# EAGLE design mem (EAGLE 8.0.2)
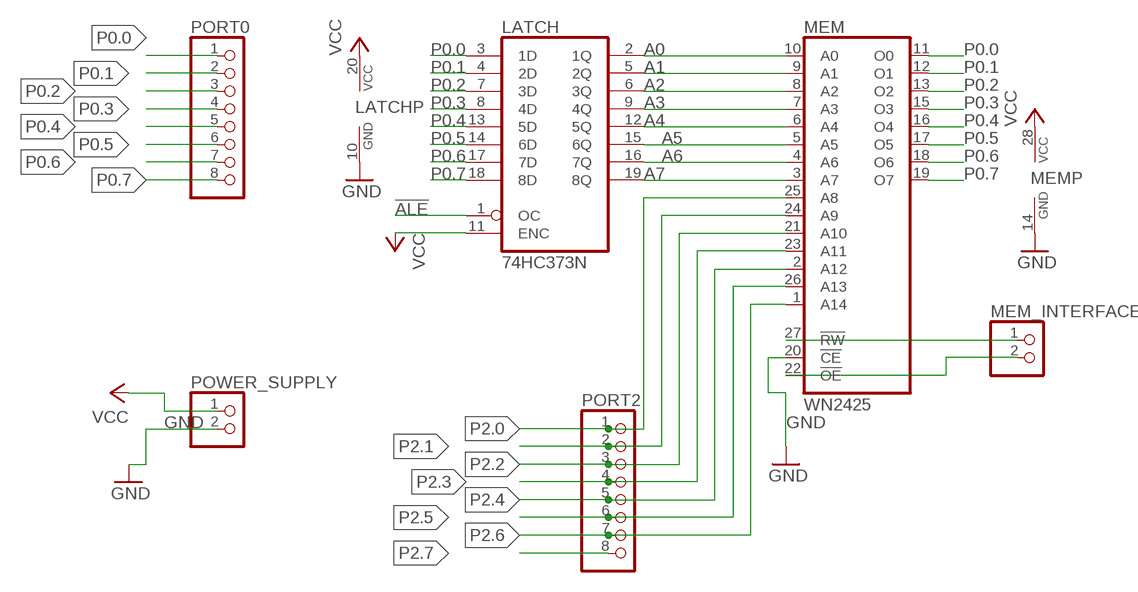
[diagram p0: schematic, sheet 1]

## Parts
LATCH  74HC373N  [DIL20]
MEM  WN2425  TC55257DP  [DIL28]
MEM_INTERFACE  PINHD-1X2  [1X02]
PORT0  PINHD-1X8  [1X08]
PORT2  PINHD-1X8  [1X08]
POWER_SUPPLY  PINHD-1X2  [1X02]

## Nets
!ALE: LATCH.1(OC)
A0: LATCH.2(1Q) MEM.10(A0)
A1: LATCH.5(2Q) MEM.9(A1)
A2: LATCH.6(3Q) MEM.8(A2)
A3: LATCH.9(4Q) MEM.7(A3)
A4: LATCH.12(5Q) MEM.6(A4)
A5: LATCH.15(6Q) MEM.5(A5)
A6: LATCH.16(7Q) MEM.4(A6)
A7: LATCH.19(8Q) MEM.3(A7)
GND: LATCH.10(GND) MEM.14(GND) MEM.20(!CE) POWER_SUPPLY.2
P0.0: LATCH.3(1D) MEM.11(O0) PORT0.1
P0.1: LATCH.4(2D) MEM.12(O1) PORT0.2
P0.2: LATCH.7(3D) MEM.13(O2) PORT0.3
P0.3: LATCH.8(4D) MEM.15(O3) PORT0.4
P0.4: LATCH.13(5D) MEM.16(O4) PORT0.5
P0.5: LATCH.14(6D) MEM.17(O5) PORT0.6
P0.6: LATCH.17(7D) MEM.18(O6) PORT0.7
P0.7: LATCH.18(8D) MEM.19(O7) PORT0.8
P2.0: MEM.25(A8) PORT2.1
P2.1: MEM.24(A9) PORT2.2
P2.2: MEM.21(A10) PORT2.3
P2.3: MEM.23(A11) PORT2.4
P2.4: MEM.2(A12) PORT2.5
P2.5: MEM.26(A13) PORT2.6
P2.6: MEM.1(A14) PORT2.7
P2.7: PORT2.8
UC_ALE: MEM.27(!RW) MEM_INTERFACE.1
UC_PSEN: MEM.22(!OE) MEM_INTERFACE.2
VCC: LATCH.11(ENC) LATCH.20(VCC) MEM.28(VCC) POWER_SUPPLY.1

## Library data of the parts
LATCH = 74xx-eu:74*373: Octal D type transparent LATCH, edge triggered
MEM = memory:TC55257DP: MEMORY
MEM_INTERFACE POWER_SUPPLY = pinhead:PINHD-1X2: PIN HEADER
PORT0 PORT2 = pinhead:PINHD-1X8: PIN HEADER

## Board
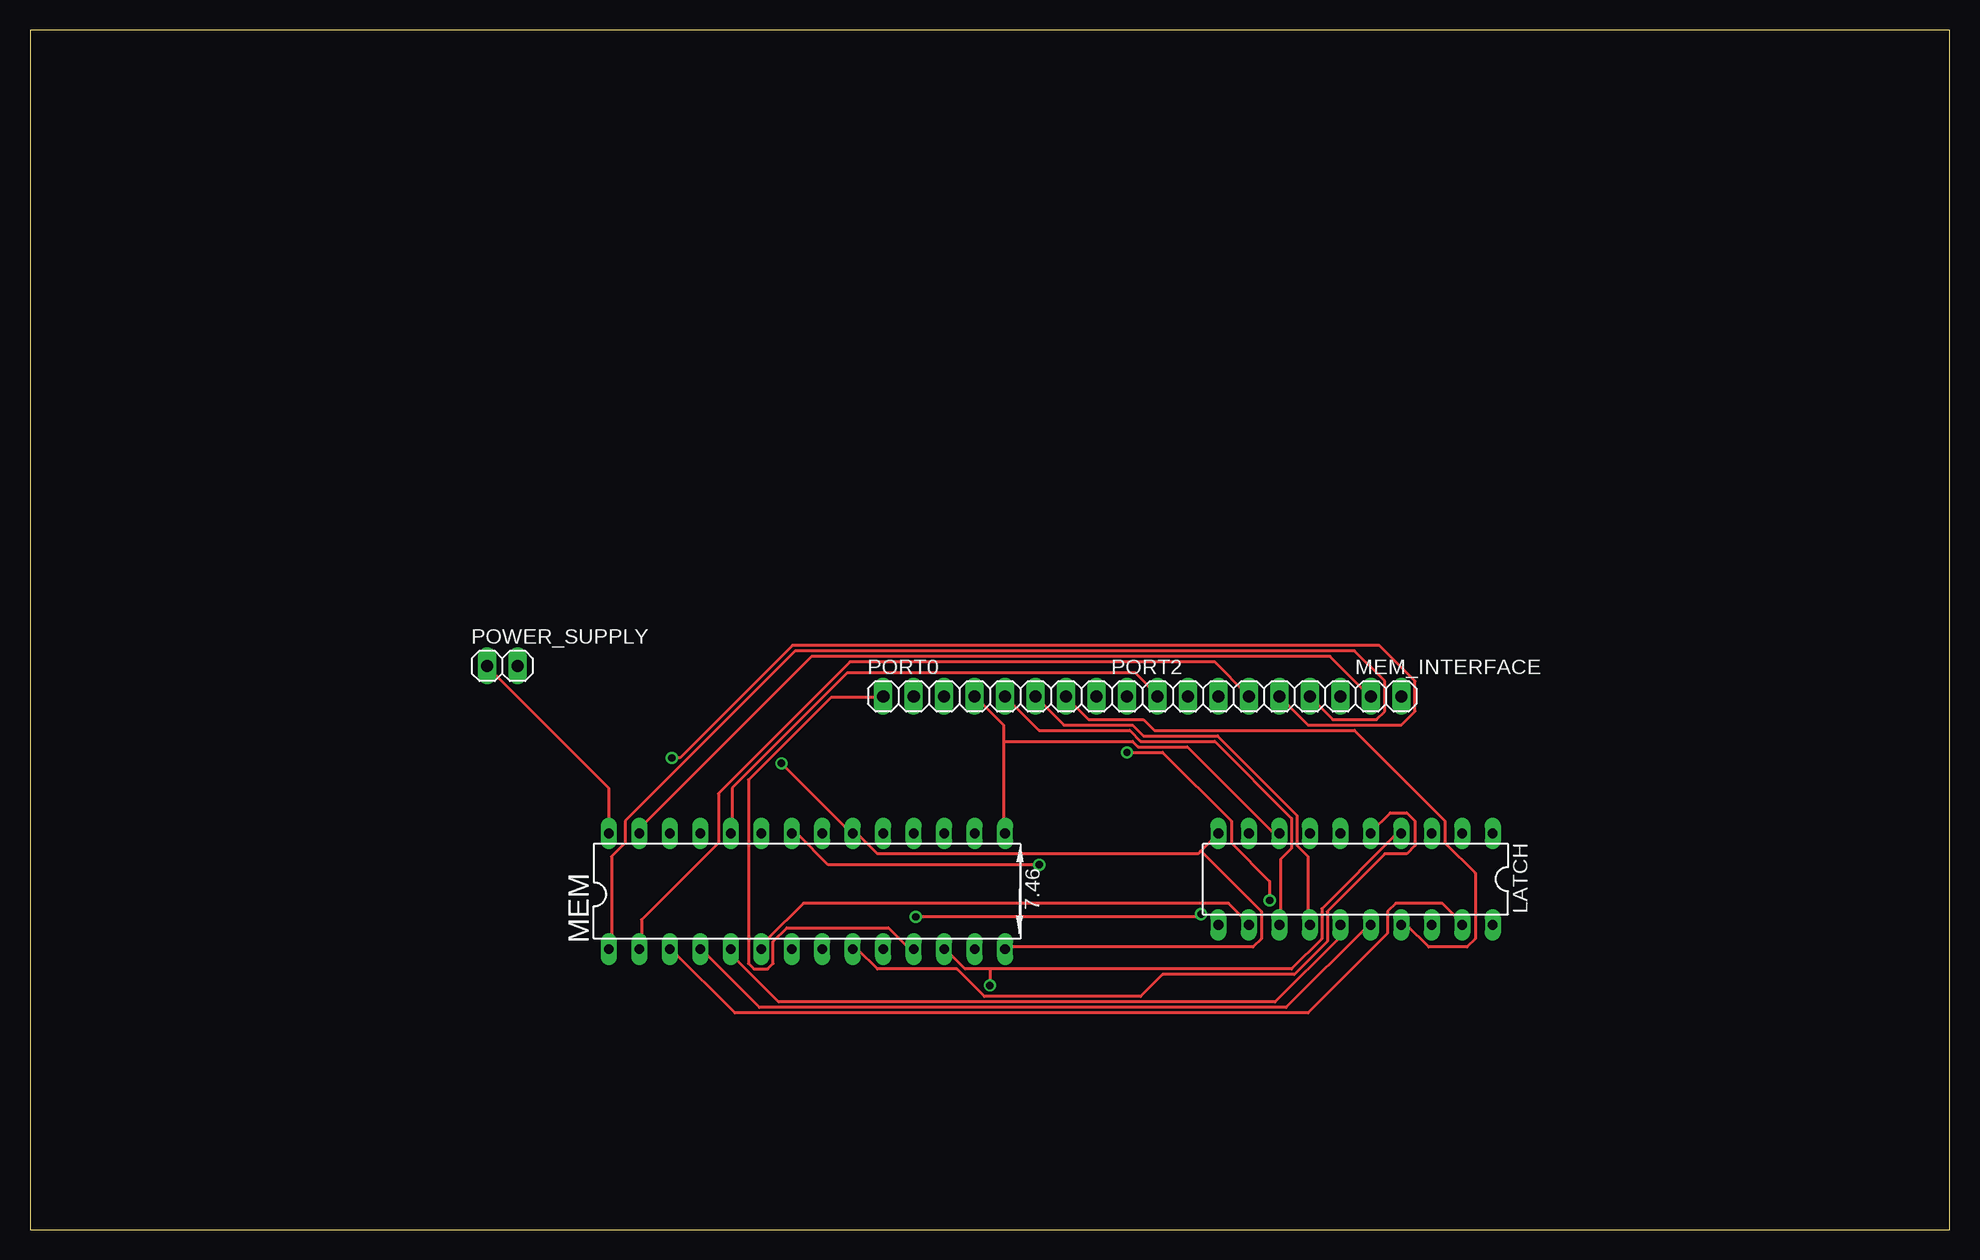
[diagram p1: board, top side]
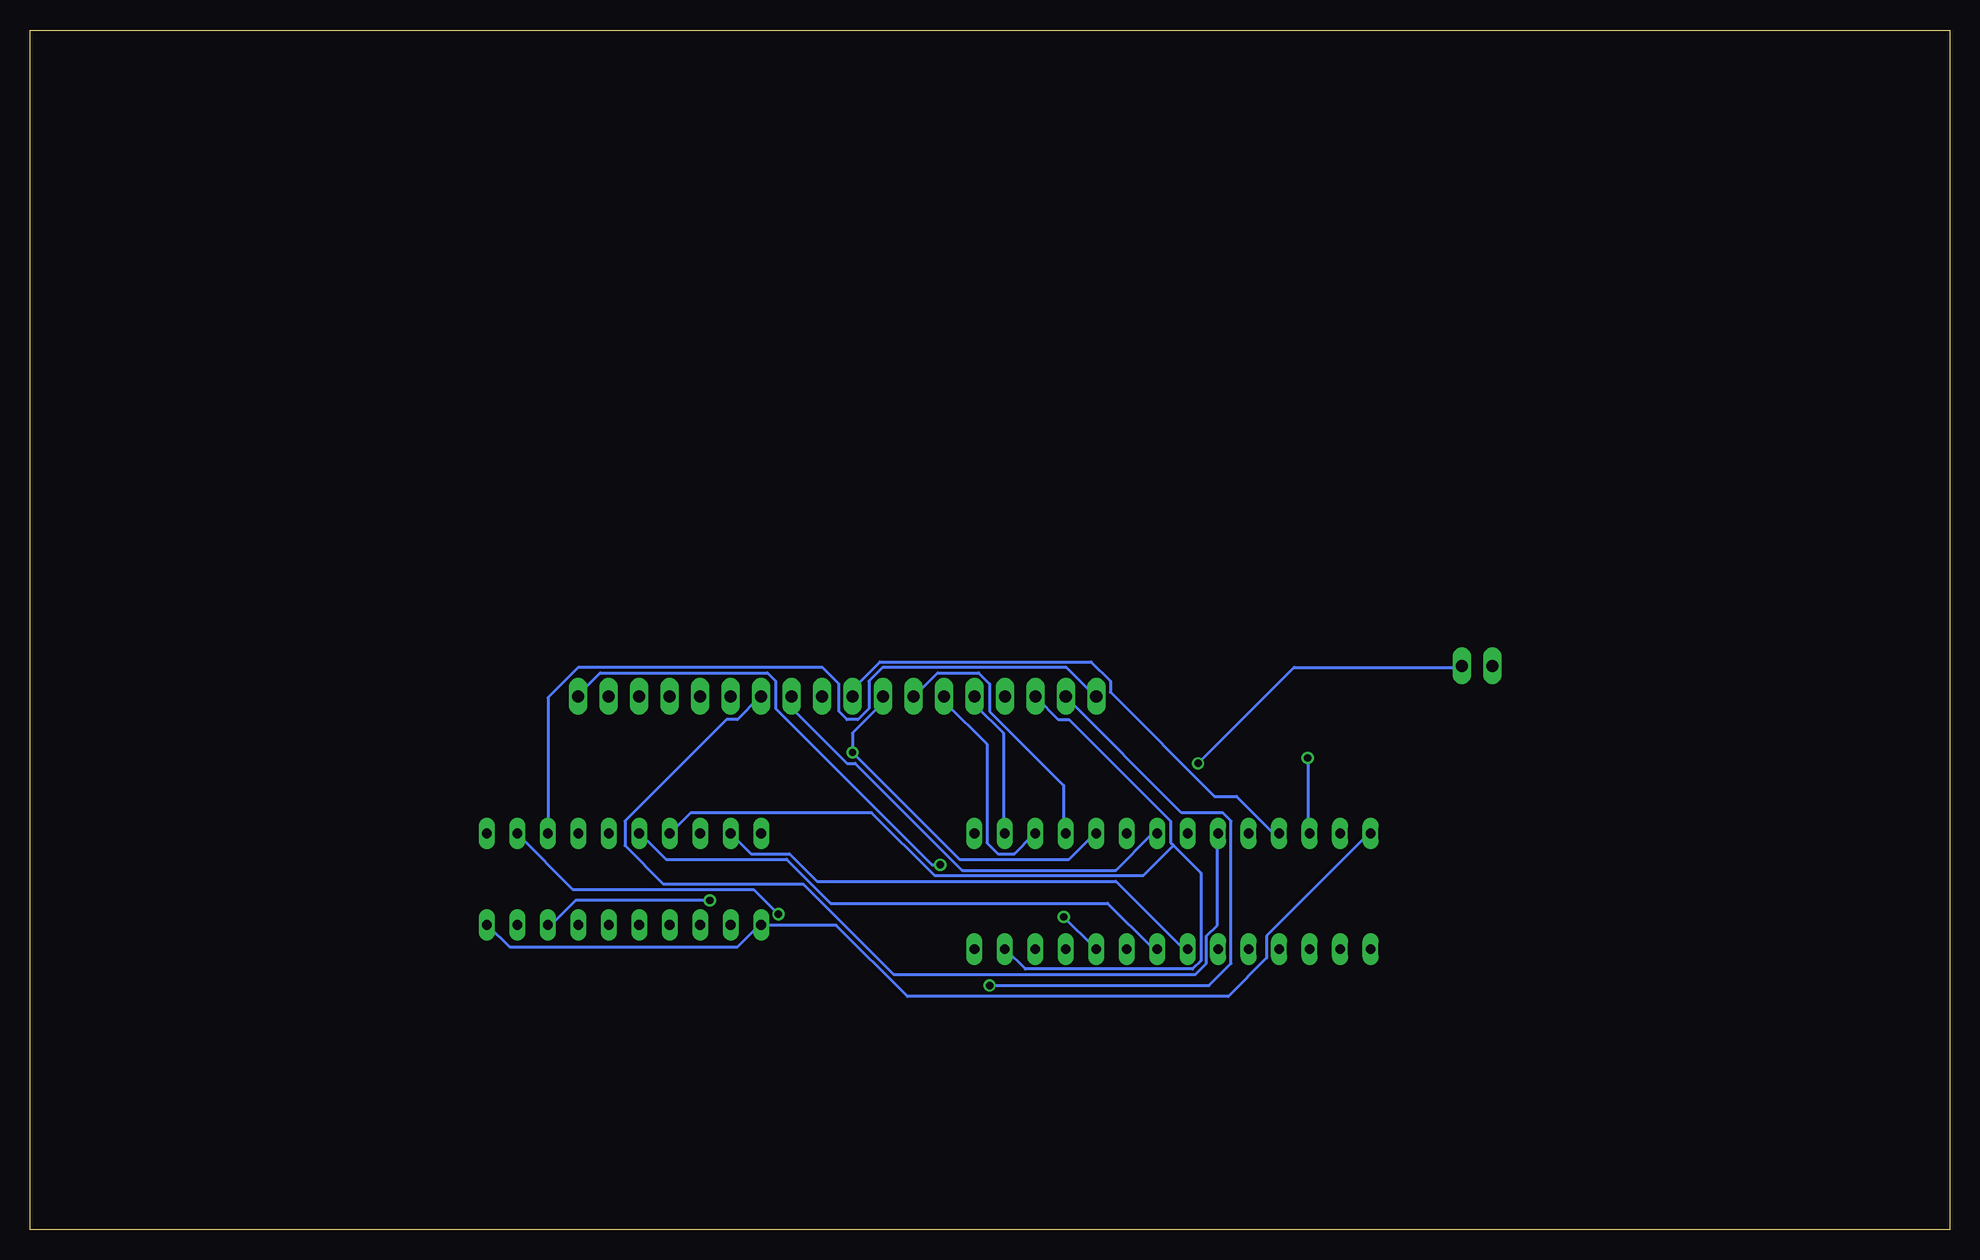
[diagram p2: board, bottom side, seen from below]

Size 160 x 100 mm. Coordinates in mm from the lower left corner, seen from the top.
Outline: 0,0 160,0 160,100 0,100 0,0
Copper layers (1*16): Top 0.035mm / dielectric 1.5mm / Bottom 0.035mm
Design rules "default": minimum track width 10mil, minimum drill 24mil, track to track 8mil, track to pad 8mil, pad to pad 8mil, via to via 8mil, smd to smd 8mil, copper to edge 40mil, drill to drill 8mil, minimum pad ring 10mil, minimum via ring 8mil, stop-mask expansion 4mil, vias tented up to drill 0mil, thermal gap 10mil

### Footprints (pad centres in the part's own frame; a part is rotated, then mirrored left to right if it is on the bottom)
DIL20 = drill 0.813 long: 1 -11.43,-3.81; 2 -8.89,-3.81; 3 -6.35,-3.81; 4 -3.81,-3.81; 5 -1.27,-3.81; 6 1.27,-3.81; 7 3.81,-3.81; 8 6.35,-3.81; 9 8.89,-3.81; 10 11.43,-3.81; 11 11.43,3.81; 12 8.89,3.81; 13 6.35,3.81; 14 3.81,3.81; 15 1.27,3.81; 16 -1.27,3.81; 17 -3.81,3.81; 18 -6.35,3.81; 19 -8.89,3.81; 20 -11.43,3.81
DIL28 = drill 0.813 long: 1 -16.51,-2.02; 2 -13.97,-2.02; 3 -11.43,-2.02; 4 -8.89,-2.02; 5 -6.35,-2.02; 6 -3.81,-2.02; 7 -1.27,-2.02; 8 1.27,-2.02; 9 3.81,-2.02; 10 6.35,-2.02; 11 8.89,-2.02; 12 11.43,-2.02; 13 13.97,-2.02; 14 16.51,-2.02; 15 16.51,7.62; 16 13.97,7.62; 17 11.43,7.62; 18 8.89,7.62; 19 6.35,7.62; 20 3.81,7.62; 21 1.27,7.62; 22 -1.27,7.62; 23 -3.81,7.62; 24 -6.35,7.62; 25 -8.89,7.62; 26 -11.43,7.62; 27 -13.97,7.62; 28 -16.51,7.62
1X02 = drill 1.016 long: 1 -1.27,0; 2 1.27,0
1X08 = drill 1.016 long: 1 -8.89,0; 2 -6.35,0; 3 -3.81,0; 4 -1.27,0; 5 1.27,0; 6 3.81,0; 7 6.35,0; 8 8.89,0

### Placement (x,y rotation side)
LATCH  110.49,29.21 180 top
MEM  64.77,25.4 0 top
MEM_INTERFACE  113.03,44.45 0 top
PORT0  80.01,44.45 0 top
PORT2  100.33,44.45 0 top
POWER_SUPPLY  39.37,46.99 0 top

### Tracks (layer width: path | path; a pad name or v marks a point on that pad's centre or on a via)
A0  (via drill 0.61)
  Top 0.254: v73.84,26.06 97.38,26.06 v97.61,26.29
  Bottom 0.254: v73.84,26.06 71.32,23.55 MEM.10 | v97.61,26.29 99.67,28.35 114.76,28.35 119.33,32.92 LATCH.2
A1
  Top 0.254: MEM.9 68.58,23.32 69.04,23.32 70.64,21.72 77.27,21.72 79.55,19.43 92.58,19.43 94.41,21.26 105.39,21.26 108.13,24 108.13,26.52 112.93,31.32 114.76,31.32 115.44,32 115.44,34.06 114.76,34.75 113.39,34.75 111.78,33.15 LATCH.5
A2
  Bottom 0.254: MEM.8 66.06,23.55 66.52,23.55 70.18,27.2 93.27,27.2 96.93,30.86 106.98,30.86 109.04,32.92 LATCH.6
A3
  Bottom 0.254: LATCH.9 99.9,31.32 96.7,31.32 94.41,29.03 69.49,29.03 64.01,23.55 63.55,23.55 MEM.7
A4
  Top 0.254: MEM.6 61.04,23.55 61.49,24 61.49,24.23 64.47,27.2 99.9,27.2 101.5,25.6 LATCH.12
A5
  Top 0.254: MEM.5 58.52,23.32 58.52,22.86 62.41,18.97 103.78,18.97 109.04,24.23 109.04,25.38 LATCH.15
A6
  Top 0.254: MEM.4 56.01,23.32 60.81,18.52 104.7,18.52 111.56,25.38 LATCH.16
A7
  Top 0.254: MEM.3 53.49,23.32 58.75,18.06 106.53,18.06 113.16,24.69 113.16,26.52 113.84,27.2 117.73,27.2 119.33,25.6 LATCH.19
GND  (via drill 0.61)
  Top 0.254: 68.58,32.92 69.04,32.92 70.64,31.32 97.38,31.32 97.61,31.55 | 97.61,31.55 98.98,32.92 LATCH.10 | 97.61,31.55 102.64,26.52 102.64,24.23 101.96,23.55 81.38,23.55 MEM.14 | 68.58,32.92 v62.64,38.86 | 68.58,32.92 MEM.20
  Bottom 0.254: v62.64,38.86 54.63,46.86 40.69,46.86 POWER_SUPPLY.2
P0.0
  Top 0.254: MEM.11 73.61,23.55 73.15,23.55 71.55,25.15 63.09,25.15 61.95,24 61.95,22.17 61.49,21.72 60.35,21.72 59.89,22.17 59.89,37.49 66.75,44.35 71.09,44.35 PORT0.1
  Bottom 0.254: LATCH.3 116.81,33.15 116.81,44.35 114.3,46.86 93.95,46.86 92.58,45.49 92.58,43.2 91.9,42.52 90.98,42.52 90.07,43.43 90.07,45.72 88.92,46.86 73.61,46.86 71.32,44.58 PORT0.1
P0.1  (via drill 0.61)
  Top 0.254: 80.01,21.72 105.16,21.72 107.67,24.23 107.67,26.75 113.84,32.92 114.3,32.92 LATCH.4 | 80.01,21.72 77.95,21.72 76.35,23.32 MEM.12 | 80.01,21.72 v80.01,20.34
  Bottom 0.254: v80.01,20.34 61.72,20.34 59.89,22.17 59.89,34.06 60.58,34.75 64.01,34.75 73.61,44.35 PORT0.2
P0.2
  Bottom 0.254: 64.69,32 64.92,32.23 64.92,34.06 73.38,42.52 74.3,42.52 76.12,44.35 PORT0.3 | 64.69,32 62.41,29.72 62.41,22.4 63.09,21.72 77.04,21.72 78.64,23.32 MEM.13 | 64.69,32 67.21,29.49 84.58,29.49 89.84,34.75 104.93,34.75 106.53,33.15 LATCH.7
P0.3
  Top 0.254: 81.15,40.69 81.15,42.06 78.87,44.35 PORT0.4 | 81.15,40.69 81.15,33.15 MEM.15 | 81.15,40.69 91.9,40.69 92.35,40.23 96.47,40.23 103.56,33.15 104.01,33.15 LATCH.8
P0.4
  Top 0.254: PORT0.5 84.12,41.6 91.67,41.6 92.58,40.69 98.75,40.69 105.16,34.29 105.16,31.77 104.24,30.86 104.24,25.6 LATCH.13
  Bottom 0.254: MEM.16 78.87,33.15 78.87,41.38 81.15,43.66 81.15,44.35 PORT0.5
P0.5
  Top 0.254: LATCH.14 106.53,25.6 106.53,31.09 105.61,32 105.61,34.52 98.98,41.15 92.81,41.15 91.9,42.06 86.18,42.06 83.9,44.35 PORT0.6
  Bottom 0.254: MEM.17 76.35,32.92 77.95,31.32 79.32,31.32 80.24,32.23 80.24,40.46 83.67,43.89 83.67,44.35 PORT0.6
P0.6
  Top 0.254: LATCH.17 114.3,25.38 114.76,25.38 116.59,23.55 119.79,23.55 120.47,24.23 120.47,29.72 117.96,32.23 117.96,34.06 110.41,41.6 93.73,41.6 92.81,42.52 88.24,42.52 86.41,44.35 PORT0.7
  Bottom 0.254: MEM.18 73.84,33.15 73.84,37.03 80.01,43.2 80.01,45.49 80.92,46.41 84.35,46.41 86.18,44.58 PORT0.7
P0.7  (via drill 0.61)
  Top 0.254: v103.33,27.43 103.33,29.03 100.13,32.23 100.13,34.06 94.41,39.78 v91.44,39.78
  Bottom 0.254: v103.33,27.43 114.53,27.43 116.36,25.6 116.81,25.6 LATCH.18 | PORT0.8 88.92,44.35 88.92,43.89 91.44,41.38 v91.44,39.78 82.53,30.86 73.38,30.86 71.32,32.92 MEM.19
P2.0
  Bottom 0.254: PORT2.1 91.44,45.03 89.15,47.32 71.55,47.32 69.95,45.72 69.95,44.81 61.27,36.12 59.44,36.12 56.46,33.15 56.01,33.15 MEM.25
P2.1
  Top 0.254: MEM.24 58.52,33.15 58.52,36.8 68.12,46.41 92.13,46.41 93.95,44.58 PORT2.2
P2.2
  Bottom 0.254: MEM.21 66.06,32.92 66.52,32.92 69.49,29.95 82.3,29.95 91.21,38.86 91.9,38.86 96.47,43.43 96.47,44.35 PORT2.3
P2.3
  Bottom 0.254: MEM.23 61.04,32.92 61.04,25.38 61.95,24.46 61.95,22.17 62.87,21.26 88.01,21.26 95.56,28.8 107.21,28.8 110.41,32 110.41,34.06 101.96,42.52 101.04,42.52 99.21,44.35 PORT2.4
P2.4
  Top 0.254: MEM.2 50.98,23.55 50.98,25.83 57.38,32.23 57.38,36.35 68.35,47.32 98.75,47.32 101.5,44.58 PORT2.5
P2.5  (via drill 0.61)
  Top 0.254: v53.49,39.32 54.18,39.32 63.55,48.69 112.47,48.69 115.44,45.72 115.44,43.2 114.3,42.06 106.53,42.06 PORT2.6
  Bottom 0.254: v53.49,39.32 53.49,33.15 MEM.26
P2.6
  Top 0.254: MEM.1 48.46,23.55 48.46,31.09 49.61,32.23 49.61,34.06 63.78,48.23 110.41,48.23 112.93,45.72 112.93,43.2 112.24,42.52 108.58,42.52 106.76,44.35 PORT2.7
UC_ALE
  Top 0.254: MEM.27 50.98,33.15 50.98,33.6 65.15,47.78 108.36,47.78 111.56,44.58 MEM_INTERFACE.1
UC_PSEN  (via drill 0.61)
  Top 0.254: v84.12,30.4 66.52,30.4 64.01,32.92 63.55,32.92 MEM.22
  Bottom 0.254: v84.12,30.4 84.81,30.4 97.84,43.43 97.84,45.72 98.53,46.41 112.47,46.41 114.3,44.58 MEM_INTERFACE.2
VCC
  Top 0.254: MEM.28 48.23,33.15 48.23,36.8 38.18,46.86 POWER_SUPPLY.1
  Bottom 0.254: LATCH.20 121.84,25.38 120.02,23.55 101.04,23.55 99.21,25.38 LATCH.11 98.98,25.38 92.81,25.38 86.87,19.43 60.12,19.43 56.92,22.63 56.92,24.46 48.46,32.92 MEM.28